# EasyEDA Pro project 滤波器.eprj

# Schematic Schematic1
Board Name: Board1; Create Date: 2025-01-24; Page Name: P1; Project Name: 带通滤波器; Schematic Name: Schematic1; Update Date: 2025-01-25; Company: 嘉立创EDA; Page Size: A4; Version: V1.0
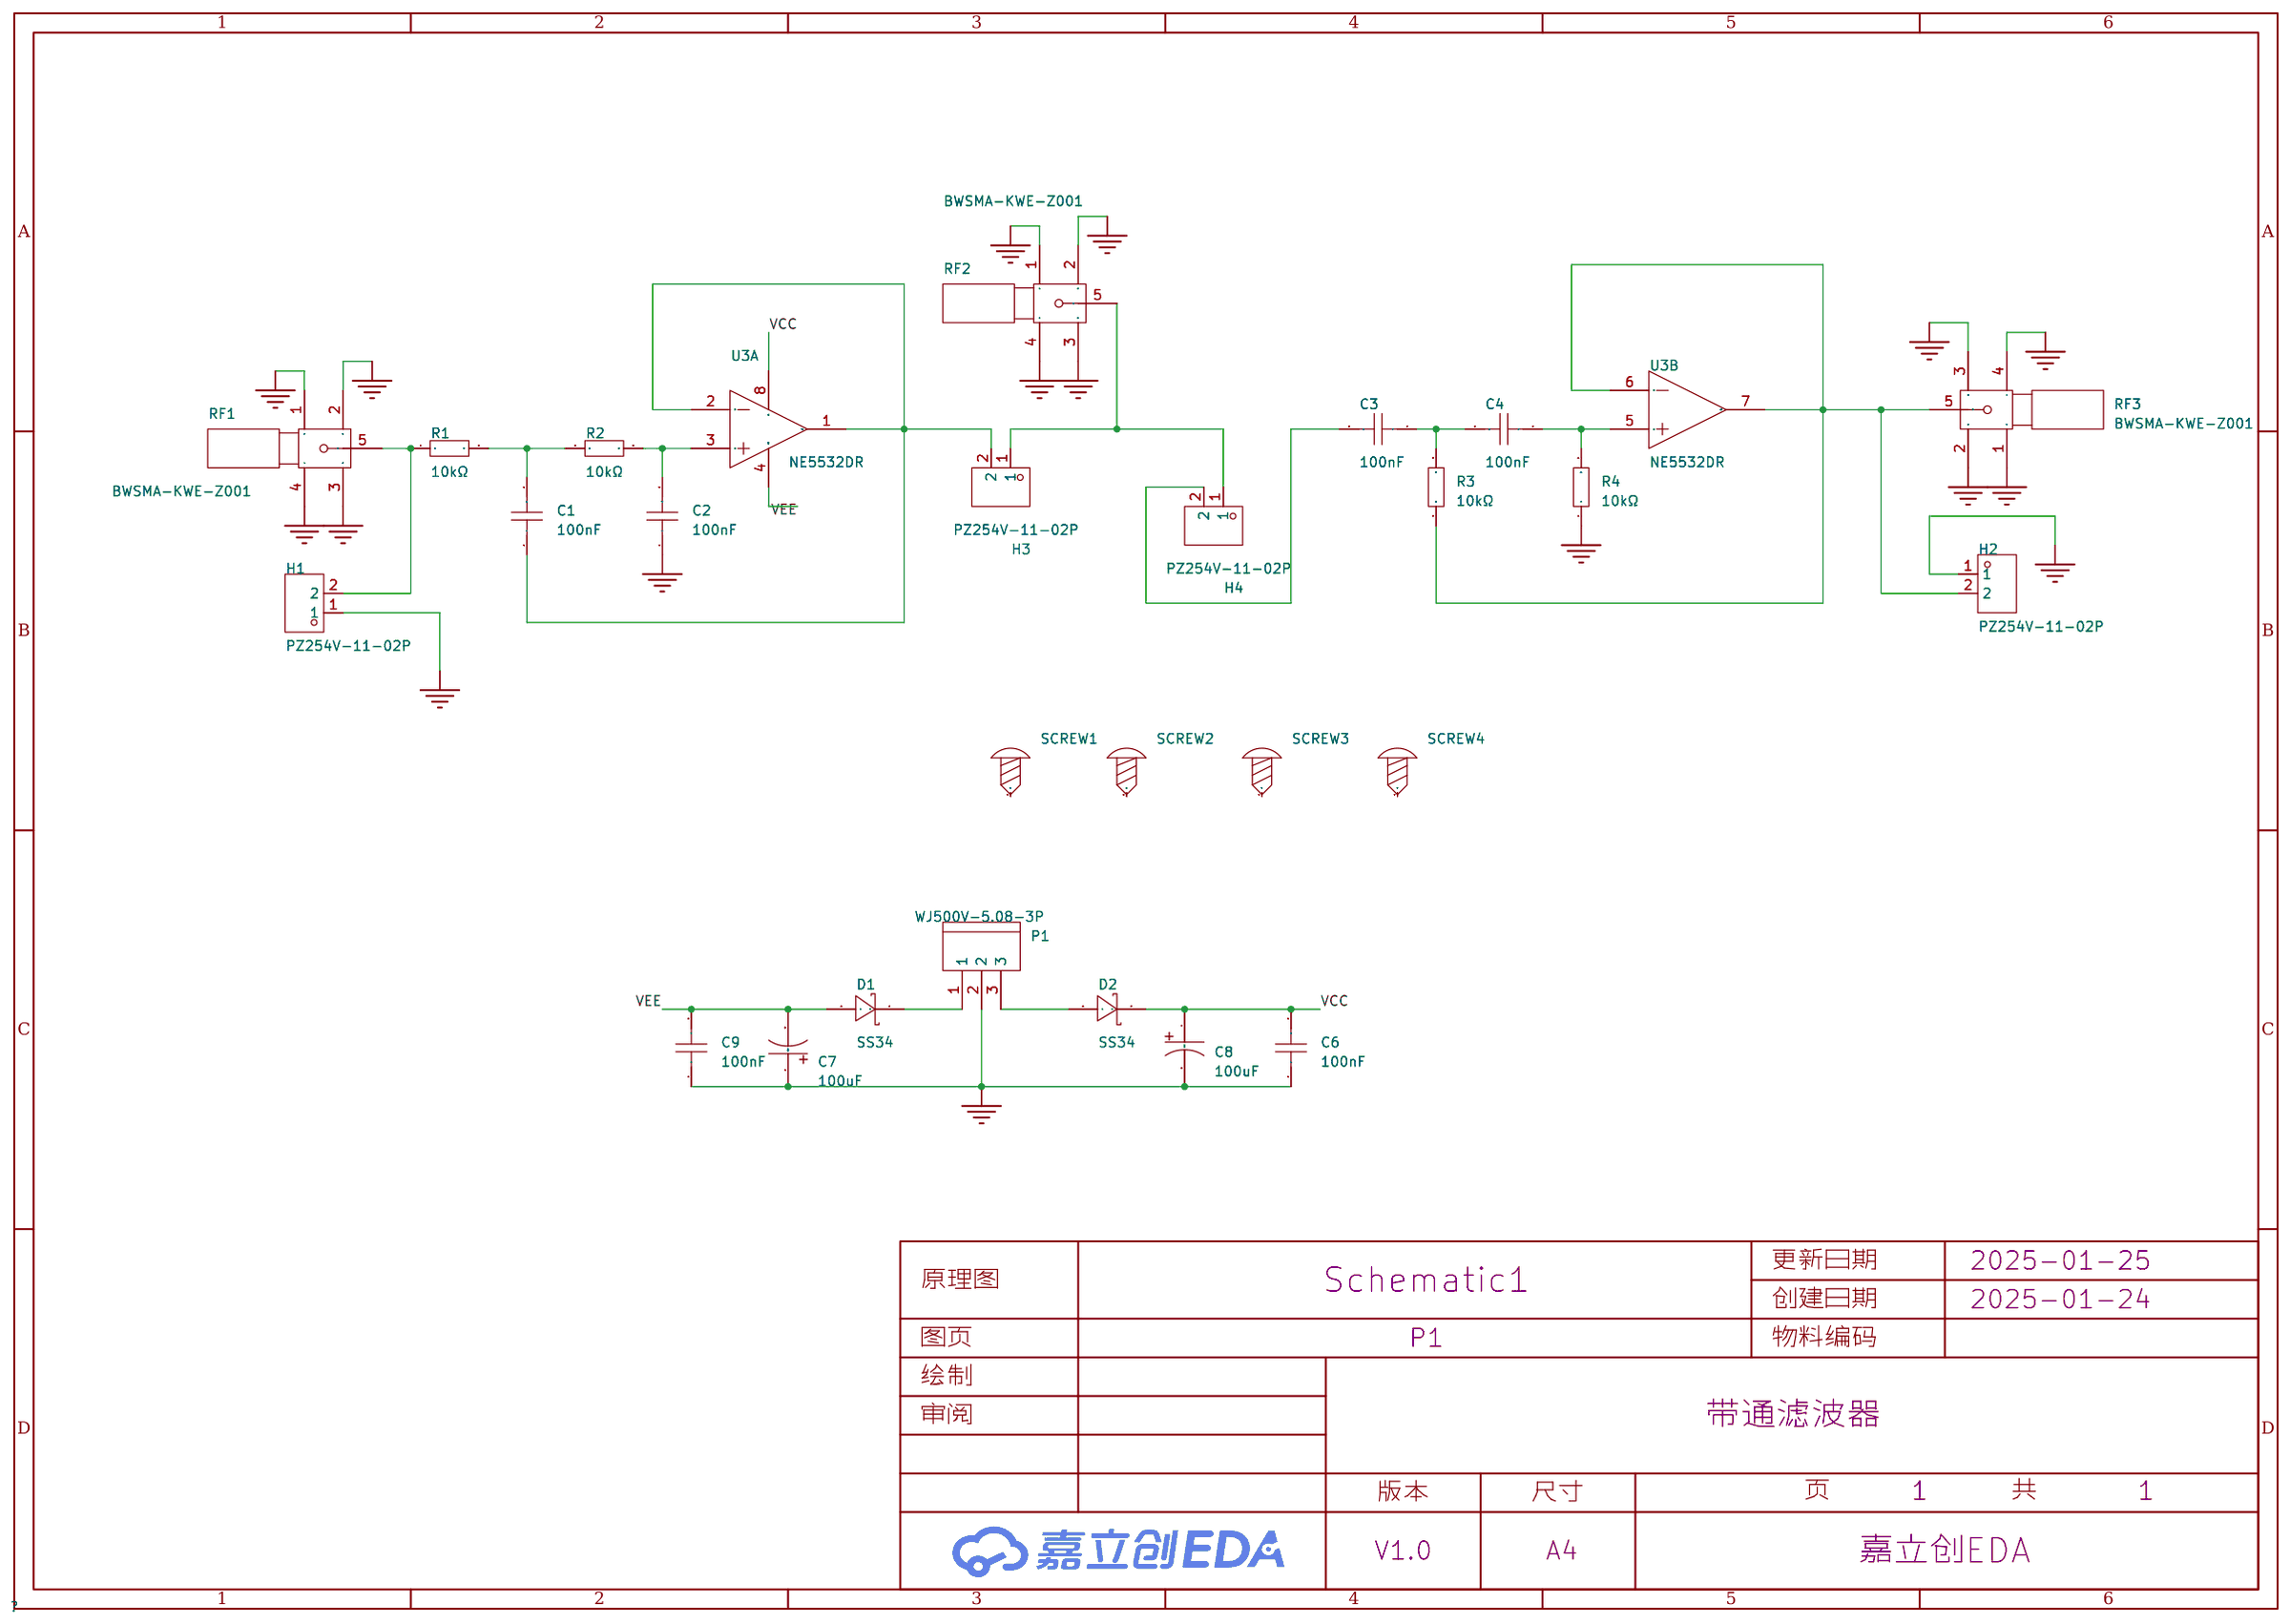
[diagram p0: schematic sheet]

## Parts
C1  100nF  [C0805]
C2  100nF  [C0805]
C3  100nF  [C0805]
C4  100nF  [C0805]
C6  100nF  [C0603]
C7  100uF  [CAP-SMD_BD6.3-L6.6-W6.6-FD]
C8  100uF  [CAP-SMD_BD6.3-L6.6-W6.6-FD]
C9  100nF  [C0603]
D1  SS34  [SMA_L4.3-W2.6-LS5.2-RD]
D2  SS34  [SMA_L4.3-W2.6-LS5.2-RD]
H1  PZ254V-11-02P  [HDR-TH_2P-P2.54-V-M]
H2  PZ254V-11-02P  [HDR-TH_2P-P2.54-V-M]
H3  PZ254V-11-02P  [HDR-TH_2P-P2.54-V-M]
H4  PZ254V-11-02P  [HDR-TH_2P-P2.54-V-M]
P1  WJ500V-5.08-3P  [CONN-TH_3P-P5.00_WJ500V-5.08-3P]
R1  10kΩ  [R0805]
R2  10kΩ  [R0805]
R3  10kΩ  [R0805]
R4  10kΩ  [R0805]
RF1  BWSMA-KWE-Z001  [SMA-TH_BWSMA-KWE-Z001]
RF2  BWSMA-KWE-Z001  [SMA-TH_BWSMA-KWE-Z001]
RF3  BWSMA-KWE-Z001  [SMA-TH_BWSMA-KWE-Z001]
SCREW1  -  [M3螺丝]
SCREW2  -  [M3螺丝]
SCREW3  -  [M3螺丝]
SCREW4  -  [M3螺丝]
U3  NE5532DR  [SOIC-8_L4.9-W3.9-P1.27-LS6.0-BL]  (sections 1,2)

## Library data of the parts
C1-C4 = CC0805KRX7R9BB104: LCSC Part Name: 100nF ±10% 50V; Supplier Part: C49678; Manufacturer: YAGEO(国巨); Supplier Footprint: 0805; JLCPCB Part Class: Basic Part; Datasheet: https://atta.szlcsc.com/upload/public/pdf/source/20180224/C181747_15194369449651363981.pdf; Supplier: LCSC; Tolerance: ±10%; Voltage Rated: 50V; Temperature Coefficient: X7R
C6 C9 = CAP_0603: Supplier Footprint: 0603
C7 C8 = EEHZK1V101XP: LCSC Part Name: 100uF ±20% 35V; Supplier Part: C454360; Manufacturer: PANASONIC(松下); Supplier Footprint: SMD,D6.3xL7.7mm; JLCPCB Part Class: 扩展库; Datasheet: https://atta.szlcsc.com/upload/public/pdf/source/20240415/C864FDB9314A367E44C3C7419E271B95.pdf; Supplier: LCSC; Tolerance: ±20%; Rated Voltage: 35V; Load Life: 4000hrs@125℃; Operating Temperature: -55℃~+125℃
D1 D2 = SS34_C8678: LCSC Part Name: 电压:40V 电流:3A; Supplier Part: C8678; Manufacturer: MDD(辰达半导体); Supplier Footprint: SMA(DO-214AC); JLCPCB Part Class: 基础库; Datasheet: https://atta.szlcsc.com/upload/public/pdf/source/20240710/2118BB86FDDB2E0B294389AC1F3F65C8.pdf; Supplier: LCSC; Diode Configuration: 独立式; Forward Voltage (Vf@If): 550mV@3A; Reverse Voltage (Vr): 40V; Rectified Current: 3A; Reverse Leakage Current (Ir): 500uA@40V
H1-H4 = PZ254V-11-02P: LCSC Part Name: 间距:2.54mm 1x2P 直插 方针; Supplier Part: C492401; Manufacturer: XFCN(兴飞); Supplier Footprint: 插件,P=2.54mm; JLCPCB Part Class: 扩展库; Datasheet: https://atta.szlcsc.com/upload/public/pdf/source/20200309/C492401_A812433581A9B211A7FFA413ADDFF0E5.pdf; Supplier: LCSC; Pin Structure: 1x2P; Pitch: 2.54mm; Circluar Pins/Square Pins: 方针; Mounting Type: 直插; Number of Rows: 单排; Number of Pins: 2P; Length of Mating Pin: 6mm; Insulation Height: 2.5mm; Length of End Connection Pin: 3mm; Contact Material: 黄铜; Operating Temperature Range: -40℃~+105℃; Color: 黑色
P1 = WJ500V-5.08-3P: LCSC Part Name: 5.08mm 1x3P 排数:1 每排P数:3 直插; Supplier Part: C72334; Manufacturer: KANGNEX(康奈克斯电气); Supplier Footprint: 插件,P=5.08mm; JLCPCB Part Class: 扩展库; Datasheet: https://atta.szlcsc.com/upload/public/pdf/source/20191225/C72334_8A5EF831D67650233B6B1E3F2BC06274.pdf; Supplier: LCSC; Structure: 1x3P; Pitch: 5.08mm; Color: 绿色; Mounting Style: 直插; Current Rating (Max): 18A; Voltage Rating (Max): 250V; Number of Pins: 3P; Number of Rows: 1; Wire Gauge - AWG: 14~30; Wire Gauge - mm2: 2.5; Number of PINs Per Row: 3; Operating Temperature Range: -40℃~+105℃
R1-R4 = 0805W8F1002T5E_C17414: LCSC Part Name: 10kΩ ±1% 125mW 厚膜电阻; Supplier Part: C17414; Manufacturer: UNI-ROYAL(厚声); Manufacturer Part: 0805W8F1002T5E; Supplier Footprint: 0805; JLCPCB Part Class: Basic Part; Datasheet: https://atta.szlcsc.com/upload/public/pdf/source/20200306/C422600_1E6D84923E4A46A82E41ADD87F860B5C.pdf; Supplier: LCSC; Type: 厚膜电阻; Tolerance: ±1%; Power(Watts): 125mW; Overload Voltage (Max): 150V; Temperature Coefficient: ±100ppm/℃; Operating Temperature Range: -55℃~+155℃
RF1-RF3 = BWSMA-KWE-Z001: LCSC Part Name: 内孔 SMA 弯头; Supplier Part: C496551; Manufacturer: BAT WIRELESS(蝙蝠无线); Supplier Footprint: 插件; JLCPCB Part Class: 扩展库; Datasheet: https://atta.szlcsc.com/upload/public/pdf/source/20231017/997A8C2ADA7F8034A89BE1264F38CE52.pdf; Supplier: LCSC; Connector Type: 板端; Interface Type: 内孔; Number of Ports: 1; Interface Diameter: 5.3mm; RF Series: SMA; Impedance: 50Ω; Style: 弯头
SCREW1-SCREW4 = M3螺丝: Supplier Footprint: 插件
U3 = NE5532DR: Supplier Part: C7426; Manufacturer: TI(德州仪器); Supplier Footprint: SOIC-8; JLCPCB Part Class: 基础库; Datasheet: http://www.ti.com/cn/lit/gpn/ne5532; Supplier: LCSC; Number of Circuits: 双路; Gain Bandwidth Product(GBP): 10MHz; Current - Input Bias(Ib): 200nA; Slew Rate(SR): 9V/us; Output Current: 38mA; Supply Current: 8mA; Operating Temperature: 0℃~+70℃

## Nets
GND: C2.1 C6.1 C7.1 C8.2 C9.1 H1.1 H2.1 P1.2 R4.1 RF1.1 RF1.2 RF1.3 RF1.4 RF2.1 RF2.2 RF2.3 RF2.4 RF3.1 RF3.2 RF3.3 RF3.4
VCC: C6.2 C8.1 D2.1(K) U3.8(VCC+)
VEE: C7.2 C9.2 D1.2(A) U3.4(VCC-/GND)
$1N251: C2.2 R2.2 U3.3(IN1+)
$1N327: C1.2 R1.2 R2.1
$1N705: H2.2 R3.1 RF3.5 U3.6(IN2-) U3.7(OUT2)
$1N777: H1.2 R1.1 RF1.5
$1N1362: C1.1 H3.2 U3.1(OUT1) U3.2(IN1-)
$1N1444: D1.1(K) P1.1
$1N1481: D2.2(A) P1.3
$1N3799: C3.1 C4.2 R3.2
$1N3813: C4.1 R4.2 U3.5(IN2+)
$1N4743: H3.1 H4.1 RF2.5
$1N4897: C3.2 H4.2

Not connected (* = marked no-connect by the designer): SCREW1 1; SCREW2 1; SCREW3 1; SCREW4 1

# Board PCB1
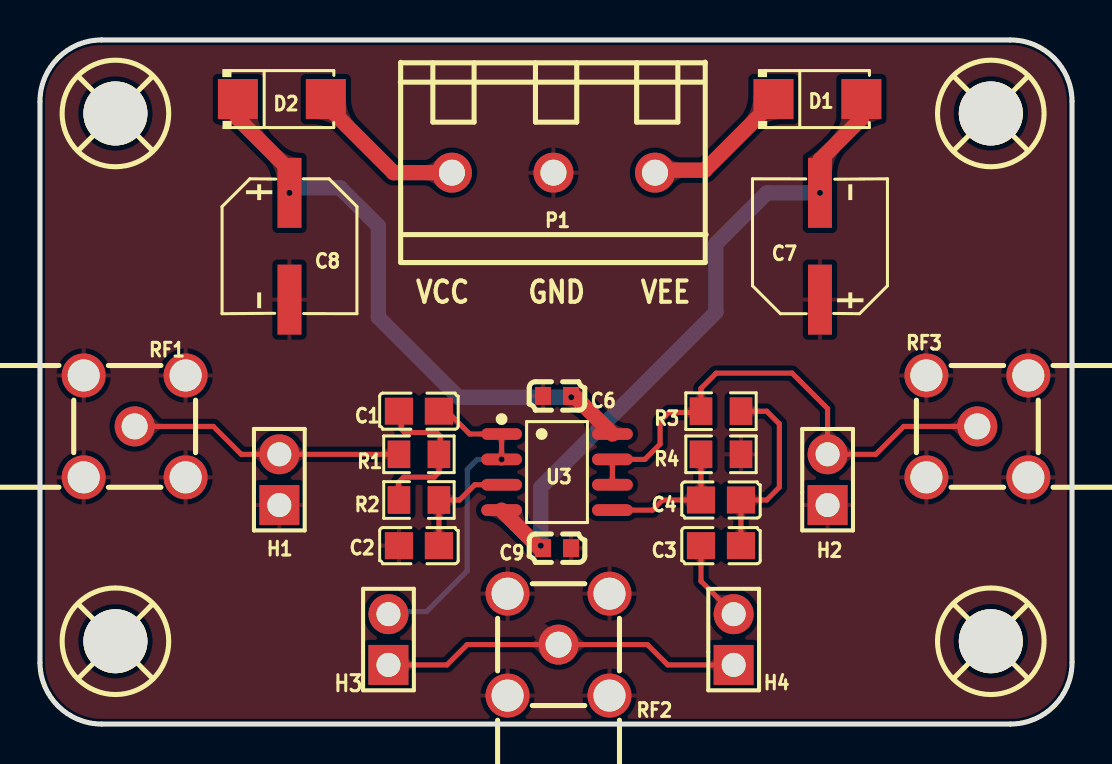
[diagram p1: board, top side]
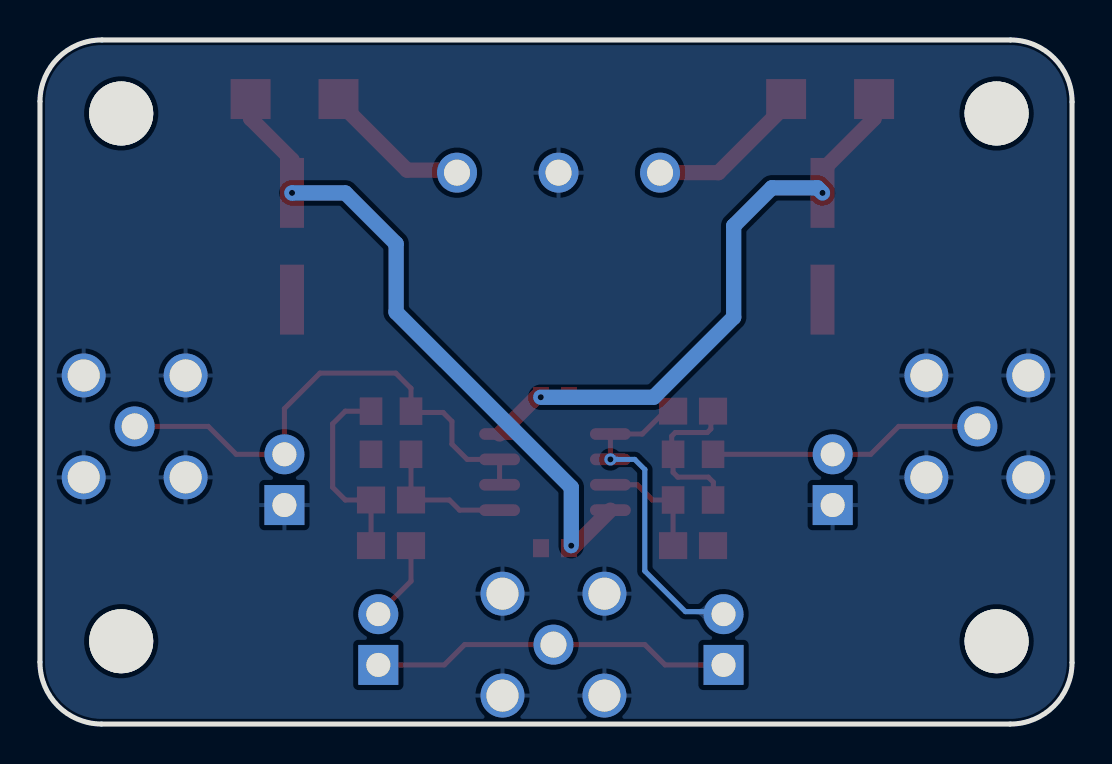
[diagram p2: board, bottom side, seen from below]

Outline 51.64 x 34.24 mm; copper layers: Top Layer, Bottom Layer. Coordinates in mm from the lower left corner of the outline.
Outline path: 0,31.14 0,3.07 arc(0.91,0.9) 3.1,0 48.56,0 arc(50.74,0.91) 51.64,3.1 51.64,31.16 arc(50.73,33.34) 48.54,34.24 3.07,34.24 arc(0.9,33.33) 0,31.14
Stack: Top Layer 0.035mm / Dielectric1 1.51mm FR4 er 4.5 / Bottom Layer 0.035mm

## Design rules (mm)
template: JLCPCB Capability(Two Layers Board)
spacing copperThickness1oz (default): track to track 0.102, other pairs 0.152 to 0.3
spacing copperThickness2oz: track to track 0.203, other pairs 0.152 to 0.3
track width copperThickness1oz (default): min 0.127, default 0.254, max 2.54
track width copperThickness2oz: min 0.203, default 0.254, max 2.54
differential pair differentialPair (default): width min 0.127, default 0.254, max 2.54; gap min 0.152, default 0.152
via viaSize (default): diameter min 0.5, default 0.61, max 10; hole min 0.3, default 0.305, max 6.3

## Placement (name value [footprint] x y rotation side)
C1  100nF  [C0805]  18.96 15.66 180 top
C2  100nF  [C0805]  18.96 8.93 0 top
C3  100nF  [C0805]  34.07 8.93 180 top
C4  100nF  [C0805]  34.07 11.21 0 top
C6  100nF  [C0603]  25.87 16.42 0 top
C7  100uF  [CAP-SMD_BD6.3-L6.6-W6.6-FD]  39.03 23.91 90 top
C8  100uF  [CAP-SMD_BD6.3-L6.6-W6.6-FD]  12.48 23.91 270 top
C9  100nF  [C0603]  25.87 8.8 180 top
D1  SS34  [SMA_L4.3-W2.6-LS5.2-RD]  38.9 31.28 0 top
D2  SS34  [SMA_L4.3-W2.6-LS5.2-RD]  12.1 31.28 0 top
H1  PZ254V-11-02P  [HDR-TH_2P-P2.54-V-M]  11.98 12.23 90 top
H2  PZ254V-11-02P  [HDR-TH_2P-P2.54-V-M]  39.41 12.23 90 top
H3  PZ254V-11-02P  [HDR-TH_2P-P2.54-V-M]  17.44 4.23 90 top
H4  PZ254V-11-02P  [HDR-TH_2P-P2.54-V-M]  34.71 4.23 90 top
P1  WJ500V-5.08-3P  [CONN-TH_3P-P5.00_WJ500V-5.08-3P]  25.69 27.6 180 top
R1  10kΩ  [R0805]  18.96 13.5 0 top
R2  10kΩ  [R0805]  18.96 11.21 0 top
R3  10kΩ  [R0805]  34.07 15.66 0 top
R4  10kΩ  [R0805]  34.07 13.5 180 top
RF1  BWSMA-KWE-Z001  [SMA-TH_BWSMA-KWE-Z001]  4.74 14.9 180 top
RF2  BWSMA-KWE-Z001  [SMA-TH_BWSMA-KWE-Z001]  25.95 3.97 270 top
RF3  BWSMA-KWE-Z001  [SMA-TH_BWSMA-KWE-Z001]  46.9 14.9 0 top
SCREW1  -  [M3螺丝]  3.78 30.56 0 top
SCREW2  -  [M3螺丝]  3.78 4.14 0 top
SCREW3  -  [M3螺丝]  47.57 4.14 0 top
SCREW4  -  [M3螺丝]  47.57 30.56 0 top
U3  NE5532DR  [SOIC-8_L4.9-W3.9-P1.27-LS6.0-BL]  25.87 12.61 270 top

## Footprints (pads in the part's own frame, mm; a bottom-side part is the same pattern mirrored in y, then rotated)
C0603
  rect 0.8x0.9 smd: 1(-0.7,0) 2(0.7,0)
C0805
  rect 1.41x1.35 smd: 1(-1,0) 2(1,0)
CAP-SMD_BD6.3-L6.6-W6.6-FD
  rect 3.5x1.2 smd: 1(-2.67,0) 2(2.67,0)
CONN-TH_3P-P5.00_WJ500V-5.08-3P
  round 2 hole 1.3: 1(-5.08,0) 2(0,0) 3(5.08,0)
HDR-TH_2P-P2.54-V-M
  rect 2x2 hole 1.2: 1(-1.27,0)
  round 2 hole 1.2: 2(1.27,0)
M3螺丝
  round 3.2 hole 3.2: 1(0,0)
R0805
  rect 1.133x1.377 smd: 1(-1,0) 2(1,0)
SMA-TH_BWSMA-KWE-Z001
  round 2.2 hole 1.6: 1(-2.55,-2.55) 2(-2.55,2.55) 3(2.55,2.55) 4(2.55,-2.55)
  round 2 hole 1.3: 5(0,0)
SMA_L4.3-W2.6-LS5.2-RD
  rect 2x2 smd: 1(-2.2,0) 2(2.2,0)
SOIC-8_L4.9-W3.9-P1.27-LS6.0-BL
  oval 0.588x2.045 smd: 1(-1.905,-2.772) 2(-0.635,-2.772) 3(0.635,-2.772) 4(1.905,-2.772) 5(1.905,2.772) 6(0.635,2.772) 7(-0.635,2.772) 8(-1.905,2.772)

## Nets
As in the schematic.

Pads without a net: SCREW1 1; SCREW2 1; SCREW3 1; SCREW4 1

## Via types
v1: diameter 0.61, hole 0.305, Top Layer to Bottom Layer, 5 vias

## Routing (per net, layer and track width the routed paths; a pad name or vN(x,y) marks a point on that pad's centre or on a via; arc(x,y) is an arc through that point)
VCC: length 29.8
  Top Layer w0.762: v1(26.58,16.36) 26.8,16.36 U3.8 ; D2.1 9.9,30.3 12.48,27.72 v1(12.48,26.58)
  Bottom Layer w0.762: v1(12.48,26.58) 12.74,26.84 15.02,26.84 16.93,24.93 16.93,20.36 20.93,16.36 v1(26.58,16.36)
VEE: length 33.4
  Top Layer w0.762: 23.1,10.71 25,8.8 C9.2 ; v1(39.03,26.58) 39.03,28.23 41.1,30.3 D1.2
  Bottom Layer w0.762: v1(25.06,8.93) 25.06,11.85 33.82,20.61 33.82,24.04 36.36,26.58 39.02,26.58 v1(39.03,26.58)
$1N251: length 5.7
  Top Layer w0.254: C2.2 R2.2 20.99,11.21 21.75,11.98 U3.3
$1N327: length 8
  Top Layer w0.254: C1.2 18.07,15.55 18.07,14.77 18.25,14.59 19.85,14.59 20.03,14.41 20.03,13.57 R1.2 19.96,12.59 19.72,12.36 18.2,12.36 17.94,12.1 17.94,11.23 R2.1
$1N705: length 26.3
  Top Layer w0.254: U3.6 U3.7 30.26,13.25 31.03,14.01 31.03,15.15 31.47,15.6 33.01,15.6 R3.1 33.07,16.8 33.84,17.56 37.63,17.56 39.41,15.79 H2.2 41.82,13.5 43.22,14.9 RF3.5
$1N777: length 14
  Top Layer w0.254: RF1.5 8.67,14.9 10.07,13.5 H1.2 17.95,13.5 18.08,13.63
$1N1362: length 17.2
  Top Layer w0.254: v1(23.1,13.25) U3.1 21.5,14.52 20.36,15.66 19.53,15.66
  Bottom Layer w0.254: v1(23.1,13.25) 21.88,13.25 21.37,12.74 21.37,7.66 19.34,5.63 17.56,5.63 H3.2
$1N1444: length 7.5
  Top Layer w0.762: P1.1 30.9,27.72 33.27,27.72 36.57,31.03 36.57,31.28
$1N1481: length 8
  Top Layer w0.762: P1.3 17.69,27.6 14.3,30.98 D2.2
$1N3799: length 9.8
  Top Layer w0.254: C3.1 C4.2 36.36,11.21 37,11.85 37,15.02 36.36,15.66 R3.2
$1N3813: length 6.9
  Top Layer w0.254: 28.64,10.71 30.65,10.71 31.15,11.21 C4.1 R4.2
$1N4743: length 18.1
  Top Layer w0.254: H3.1 20.36,2.96 21.37,3.97 RF2.5 30.39,3.97 31.41,2.96 H4.1
$1N4897: length 4.1
  Top Layer w0.254: C3.2 33.07,7.15 34.71,5.52 H4.2

## Copper pours and planes (outline as drawn; the poured copper is in the pictures)
GND on Top Layer: -0.72,35.34 52.49,35.34 52.49,-0.85 -0.72,-0.85
GND on Bottom Layer: -0.47,35.09 52.36,35.09 52.36,-1.11 -0.47,-1.11

Small or netless copper shapes (teardrops, artwork), in the pictures only: 52 on Top Layer, 2 on Bottom Layer

## Text on the board
Top Silkscreen Layer: H3 | VCC | GND | VEE
